# Altium schematic sheet gydrodrive_encoder.SchDoc
size 297 x 209 mm; SheetNumber: 22; SheetTotal: 22
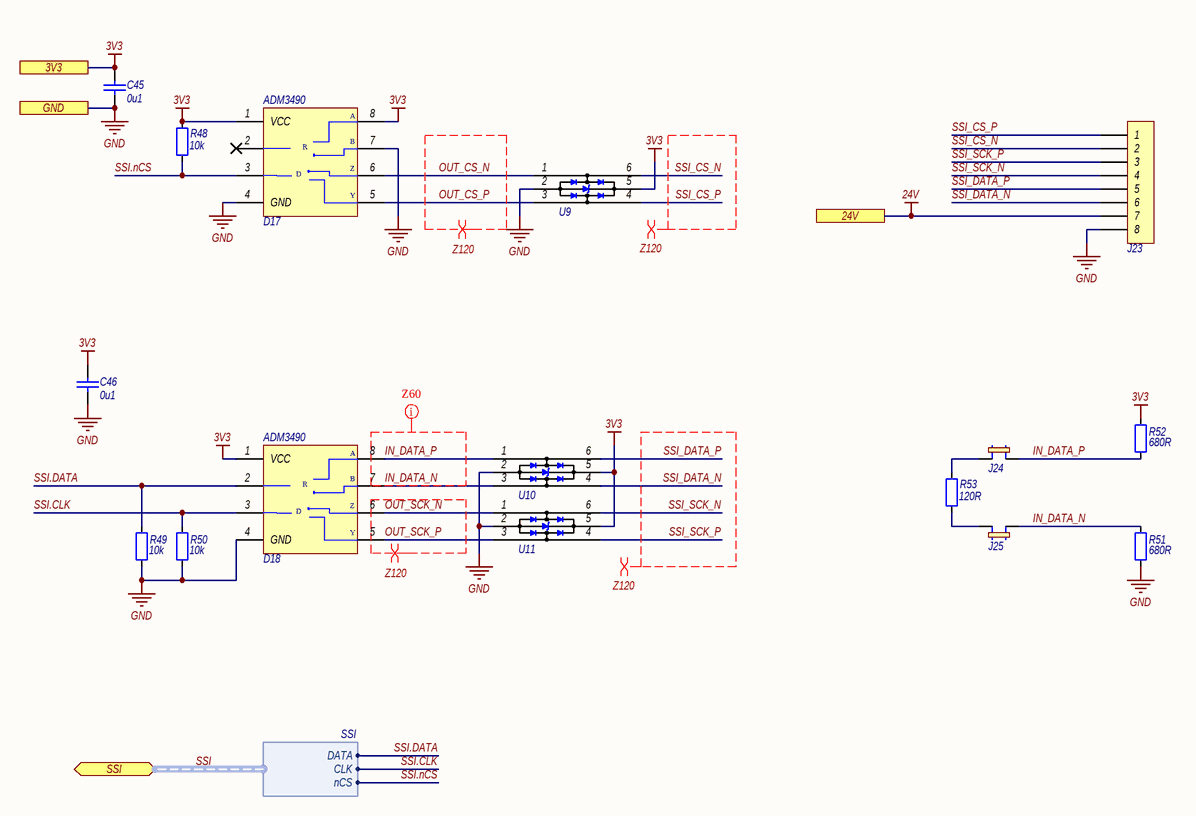
[diagram p0: gydrodrive_encoder.SchDoc]

## Parts
C45  Capacitance: 0u1  [CAPC2012-0805M]  (hidden comment: CAP_0805)
C46  Capacitance: 0u1  [CAPC2012-0805M]  (hidden comment: CAP_0805)
D17  ADM3490  [SO8_M]
D18  ADM3490  [SO8_M]
J23  DG142V-5.08-08P  [DG142V-5.08-08P]  (value not drawn)
J24  PLS-2.54-2 JUMP  [PLS-2-2.54]  (value not drawn)
J25  PLS-2.54-2 JUMP  [PLS-2-2.54]  (value not drawn)
R48  Resistance: 10k  [RESC2012-0805M]  (hidden comment: RES_0805)
R49  Resistance: 10k  [RESC2012-0805M]  (hidden comment: RES_0805)
R50  Resistance: 10k  [RESC2012-0805M]  (hidden comment: RES_0805)
R51  Resistance: 680R  [RESC3216-1206M]  (hidden comment: RES_1206)
R52  Resistance: 680R  [RESC3216-1206M]  (hidden comment: RES_1206)
R53  Resistance: 120R  [RESC3216-1206M]  (hidden comment: RES_1206)
U9  USBLC6-2SC6  [SOT23-6AM]  (value not drawn)
U10  USBLC6-2SC6  [SOT23-6AM]  (value not drawn)
U11  USBLC6-2SC6  [SOT23-6AM]  (value not drawn)

## Ports
3V3 (see gydrodrive_main[4D], gydrodrive_button[3B], gydrodrive_can[3B], gydrodrive_debugger[3B], gydrodrive_indication[4C], gydrodrive_inputTrim[4B], gydrodrive_interfaces[3C], gydrodrive_mcu[4C], gydrodrive_rs485[4B], gydrodrive_sto[3B], gydrodrive_supply[5B]), 24V (see gydrodrive_main[4C], gydrodrive_button[4B], gydrodrive_control[4B], gydrodrive_currentSource[2B], gydrodrive_discreteControl[4B], gydrodrive_linearPosSensor[3B], gydrodrive_sensor[3B], gydrodrive_sensors[2B], gydrodrive_sto[4B], gydrodrive_supply[2B]), GND (see gydrodrive_main[4D], gydrodrive_button[3C], gydrodrive_can[3C], gydrodrive_control[3B], gydrodrive_currentSource[2B], gydrodrive_debugger[4C], gydrodrive_discreteControl[3B], gydrodrive_i2c[5C], gydrodrive_indication[4C], gydrodrive_inputTrim[4C], gydrodrive_interfaces[3A], gydrodrive_linearPosSensor[2C], gydrodrive_mcu[6D], gydrodrive_reservedPins[4B], gydrodrive_rs485[3B], gydrodrive_sensor[3C], gydrodrive_sensors[2B], gydrodrive_sto[3C], gydrodrive_supply[2C], gydrodrive_uart[4C]), SSI (bidir, harness SSI, see gydrodrive_main[3D], gydrodrive_mcu[1D])

## Harnesses
SSI: DATA, CLK, nCS

## Nets
3V3: C45.2 C46.2 D17.1(VCC) D17.8(A) D18.1(VCC) R48.2 R52.2 U9.5(Vbus) U10.5(Vbus) U11.5(Vbus) ; port 3V3
24V: J23.7 ; port 24V
GND: C45.1 C46.1 D17.4(GND) D17.7(B) D18.4(GND) J23.8 R49.1 R50.1 R51.2 U9.2(GND) U10.2(GND) U11.2(GND) ; port GND
IN_DATA_N: D18.7(B) J25.1 R51.1 U10.3(IO2)
IN_DATA_P: D18.8(A) J24.1 R52.1 U10.1(IO1)
OUT_CS_N: D17.6(Z) U9.1(IO1)
OUT_CS_P: D17.5(Y) U9.3(IO2)
OUT_SCK_N: D18.6(Z) U11.1(IO1)
OUT_SCK_P: D18.5(Y) U11.3(IO2)
SSI.CLK: D18.3(DI) R50.2 ; port SSI.CLK
SSI.DATA: D18.2 R49.2 ; port SSI.DATA
SSI.nCS: D17.3(DI) R48.1 ; port SSI.nCS
SSI_CS_N: J23.2 U9.6(IO1)
SSI_CS_P: J23.1 U9.4(IO2)
SSI_DATA_N: J23.6 U10.4(IO2)
SSI_DATA_P: J23.5 U10.6(IO1)
SSI_SCK_N: J23.4 U11.6(IO1)
SSI_SCK_P: J23.3 U11.4(IO2)
NetJ24_2: J24.2 R53.2
NetJ25_2: J25.2 R53.1

Not connected (* = marked no-connect by the designer): D17 2*

## Buses and harness runs
harness SSI = port SSI

## Layout directives
differential pair; differential pair class Z120: OUT_CS_N, OUT_CS_P, OUT_SCK_N, OUT_SCK_P, SSI_CS_N, SSI_CS_P, SSI_DATA_N, SSI_DATA_P, SSI_SCK_N, SSI_SCK_P
net class Z60: IN_DATA_N, IN_DATA_P

## Notes on the sheet
- Подп. и дата
- Инв. № дубл.
- Взам. инв. №
- Инв. № подл.
- Изм.
- Лист
- № докум.
- Подп.
- Дата
- Копировал
- Формат
- A4
- (in symbol ADM3490) R; D

## Library data of the parts
C45 C46 = CAPC_0805: Конденсатор керамический, корпус 0805; Parameters: 0u1,  50V; Voltage: 50V; Max Price: 5; Part Number: CAPC_0805; Part Name: ='Конд-р керам. 0805,  '  + Parameters; Component Type: Standart; Pin Count: 2
D17 D18 = ADM3490: Дифференциальный приемопередатчик rs422; Part Name: Микросхема ADM3490; Parameters: 3V3; Max Price: 300; Part Number: ADM3490; Component Type: Standart
J23 = DG142V-5.08-08P: Клеммник 8-контактный, шаг 5.08 мм; Part Name: Клеммник DG142V-5.08-08P; Parameters: 8А; Max Price: 60; System: Connector; Part Number: DG142V-5.08-08P; Component Type: Standart; Pin Count: 8
J24 J25 = PLS-2.54-2 JUMP: Разъем штыревой шаг 2.54 мм; Part Name: Разъем PLS-2, шаг 2.54 мм; Parameters: 2.54 мм; Max Price: 10; System: Connector; Part Number: PLS-2.54-2 JUMP; Component Type: Standart; Pin Count: 2
R48-R50 = RESC_0805: Рез-р, корпус 0805; Tolerance: 5%; Parameters: 10k, 5%; Max Price: 3; Part Number: RESC_0805; Part Name: ='Рез-р 0805, ' + Parameters; Component Type: Standart
R51 R52 = RESC_1206: Рез-р, корпус 1206; Tolerance: 5%; Parameters: 680R, 5%; Max Price: 12; Part Number: RESC_1206; Part Name: ='Рез-р 1206, ' + Parameters; Component Type: Standart
R53 = RESC_1206: Рез-р, корпус 1206; Tolerance: 5%; Parameters: 120R, 5%; Max Price: 12; Part Number: RESC_1206; Part Name: ='Рез-р 1206, ' + Parameters; Component Type: Standart
U9-U11 = USBLC6-2SC6: Диодная сборка для защиты дифференциальной линии; Part Name: Диодная сборка USBLC6-2SC6; Parameters: 5.25V; Max Price: 30; Part Number: USBLC6-2SC6; Component Type: Standart; Pin Count: 6; Voltage: 5.25V